# EAGLE design PowerDriver-Shield-v13 (EAGLE 5.11)
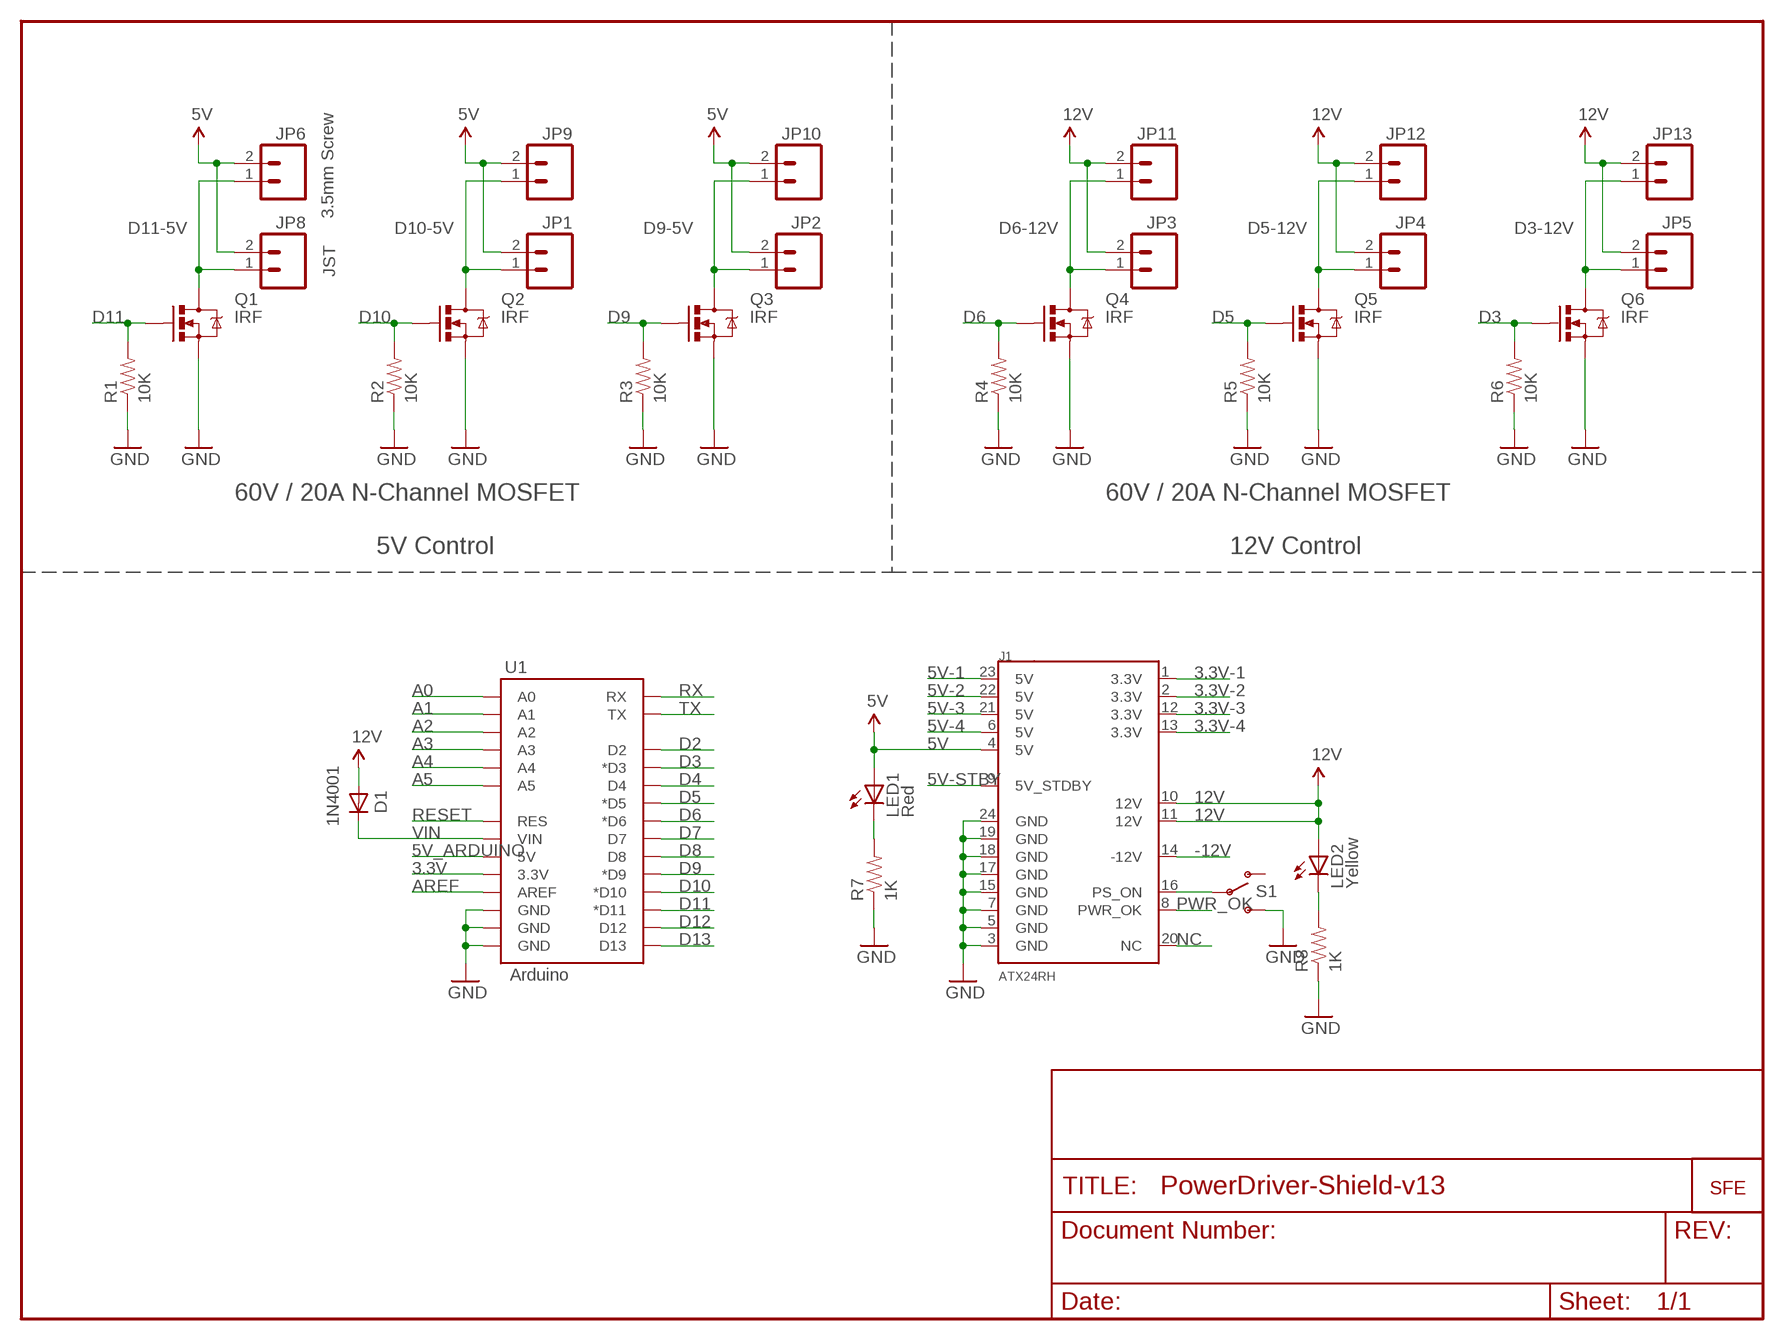
[diagram p0: schematic, sheet 1]

## Parts
D1  1N4001  DIODEPTH  [DIODE-1N4001]
J1  ATX24RH  [ATX24_RIGHT_ANGLE]
JP1  M02JST-PTH-2-NS  [JST-2-PTH-NOSILK]
JP2  M02JST-PTH-2-NS  [JST-2-PTH-NOSILK]
JP3  M02JST-PTH-2-NS  [JST-2-PTH-NOSILK]
JP4  M02JST-PTH-2-NS  [JST-2-PTH-NOSILK]
JP5  M02JST-PTH-2-NS  [JST-2-PTH-NOSILK]
JP6  M023.5MM  [SCREWTERMINAL-3.5MM-2]
JP7  LOGO-SFENEW  [SFE-NEW-WEBLOGO]
JP8  M02JST-PTH-2-NS  [JST-2-PTH-NOSILK]
JP9  M023.5MM  [SCREWTERMINAL-3.5MM-2]
JP10  M023.5MM  [SCREWTERMINAL-3.5MM-2]
JP11  M023.5MM  [SCREWTERMINAL-3.5MM-2]
JP12  M023.5MM  [SCREWTERMINAL-3.5MM-2]
JP13  M023.5MM  [SCREWTERMINAL-3.5MM-2]
LED1  Red  LED5MM  [LED5MM]
LED2  Yellow  LED5MM  [LED5MM]
Q1  IRF  MOSFET-NCHANNELPTH2  [TO220V]
Q2  IRF  MOSFET-NCHANNELPTH2  [TO220V]
Q3  IRF  MOSFET-NCHANNELPTH2  [TO220V]
Q4  IRF  MOSFET-NCHANNELPTH2  [TO220V]
Q5  IRF  MOSFET-NCHANNELPTH2  [TO220V]
Q6  IRF  MOSFET-NCHANNELPTH2  [TO220V]
R1  10K  RESISTORAXIAL-0.3  [AXIAL-0.3]
R2  10K  RESISTORAXIAL-0.3  [AXIAL-0.3]
R3  10K  RESISTORAXIAL-0.3  [AXIAL-0.3]
R4  10K  RESISTORAXIAL-0.3  [AXIAL-0.3]
R5  10K  RESISTORAXIAL-0.3  [AXIAL-0.3]
R6  10K  RESISTORAXIAL-0.3  [AXIAL-0.3]
R7  1K  RESISTORAXIAL-0.3  [AXIAL-0.3]
R8  1K  RESISTORAXIAL-0.3  [AXIAL-0.3]
S1  SWITCH-SPSTPTH  [SWITCH-SPDT]
U1  Arduino  ARDUINO_SHIELDLABEL  [DUEMILANOVE_SHIELD]

## Nets
3.3V: U1.3.3V
3.3V-1: J1.1(3.3V)
3.3V-2: J1.2(3.3V)
3.3V-3: J1.12(3.3V)
3.3V-4: J1.13(3.3V)
5V: J1.4(5V) JP1.2 JP2.2 JP6.2 JP8.2 JP9.2 JP10.2 LED1.A
5V-1: J1.23(5V)
5V-2: J1.22(5V)
5V-3: J1.21(5V)
5V-4: J1.6(5V)
5V-STBY: J1.9(5V_STDBY)
5V_ARDUINO: U1.5V
12V: D1.A J1.10(12V) J1.11(12V) JP3.2 JP4.2 JP5.2 JP11.2 JP12.2 JP13.2 LED2.A
-12V: J1.14(-12V)
A0: U1.A0
A1: U1.A1
A2: U1.A2
A3: U1.A3
A4: U1.A4
A5: U1.A5
AREF: U1.AREF
D2: U1.D2
D3: Q6.1(G) R6.P$2 U1.D3(*D3)
D3-12V: JP5.1 JP13.1 Q6.2(D)
D4: U1.D4
D5: Q5.1(G) R5.P$2 U1.D5(*D5)
D5-12V: JP4.1 JP12.1 Q5.2(D)
D6: Q4.1(G) R4.P$2 U1.D6(*D6)
D6-12V: JP3.1 JP11.1 Q4.2(D)
D7: U1.D7
D8: U1.D8
D9: Q3.1(G) R3.P$2 U1.D9(*D9)
D9-5V: JP2.1 JP10.1 Q3.2(D)
D10: Q2.1(G) R2.P$2 U1.D10(*D10)
D10-5V: JP1.1 JP9.1 Q2.2(D)
D11: Q1.1(G) R1.P$2 U1.D11(*D11)
D11-5V: JP6.1 JP8.1 Q1.2(D)
D12: U1.D12
D13: U1.D13
GND: J1.3(GND) J1.5(GND) J1.7(GND) J1.15(GND) J1.17(GND) J1.18(GND) J1.19(GND) J1.24(GND) Q1.3(S) Q2.3(S) Q3.3(S) Q4.3(S) Q5.3(S) Q6.3(S) R1.P$1 R2.P$1 R3.P$1 R4.P$1 R5.P$1 R6.P$1 R7.P$1 R8.P$1 S1.3(S) U1.GND@0(GND) U1.GND@1(GND) U1.GND@2(GND)
N$1: LED2.K(C) R8.P$2
N$2: J1.16(PS_ON) S1.2(P)
N$13: LED1.K(C) R7.P$2
NC: J1.20(NC)
PWR_OK: J1.8(PWR_OK)
RESET: U1.RES
RX: U1.RX
TX: U1.TX
VIN: D1.C U1.VIN
Unconnected: S1.1(O)

## Notes on the sheet
- 3.5mm Screw
- JST
- 60V / 20A N-Channel MOSFET | 60V / 20A N-Channel MOSFET
- 5V Control | 12V Control

## Library data of the parts
D1 = SparkFun:DIODE: Diode These are standard reverse protection diodes and small signal diodes. SMA package can handle up to about 1A. SOD-323 can handle about 200mA. What the SOD-323 package when ordering, there are some mfgs out there that are 5-pin packages.
J1 = SparkFun:ATX24
JP1-JP6 JP8-JP13 = SparkFun:M02: Header 2 Standard 2-pin 0.1" header. Use with straight break away headers (SKU : PRT-00116), right angle break away headers (PRT-00553), swiss pins (PRT-00743), machine pins (PRT-00117), and female headers (PRT-00115). Molex polarized connector foot print use with SKU : PRT-08233 with associated crimp pins and housings.
JP7 = SparkFun:LOGO-SFE: Spark Fun Electronics PCB Logo This is the standard Spark Fun Electronics PCB logo.
LED1 LED2 = SparkFun:LED: LEDs Standard schematic elements and footprints for 5mm, 3mm, 1206, and 0603 sized LEDs. 5mm - Spark Fun Electronics SKU : COM-00529 (and others)
Q1-Q6 = SparkFun:MOSFET-NCHANNEL
R1-R8 = SparkFun:RESISTOR: Resistor Basic schematic elements and footprints for 0603, 1206, and PTH resistors.
S1 = SparkFun:SWITCH-SPST: SPST Switch Simple slide switch. Spark Fun Electronics SKU : COM-00102
U1 = SparkFun:ARDUINO_SHIELD

## Board
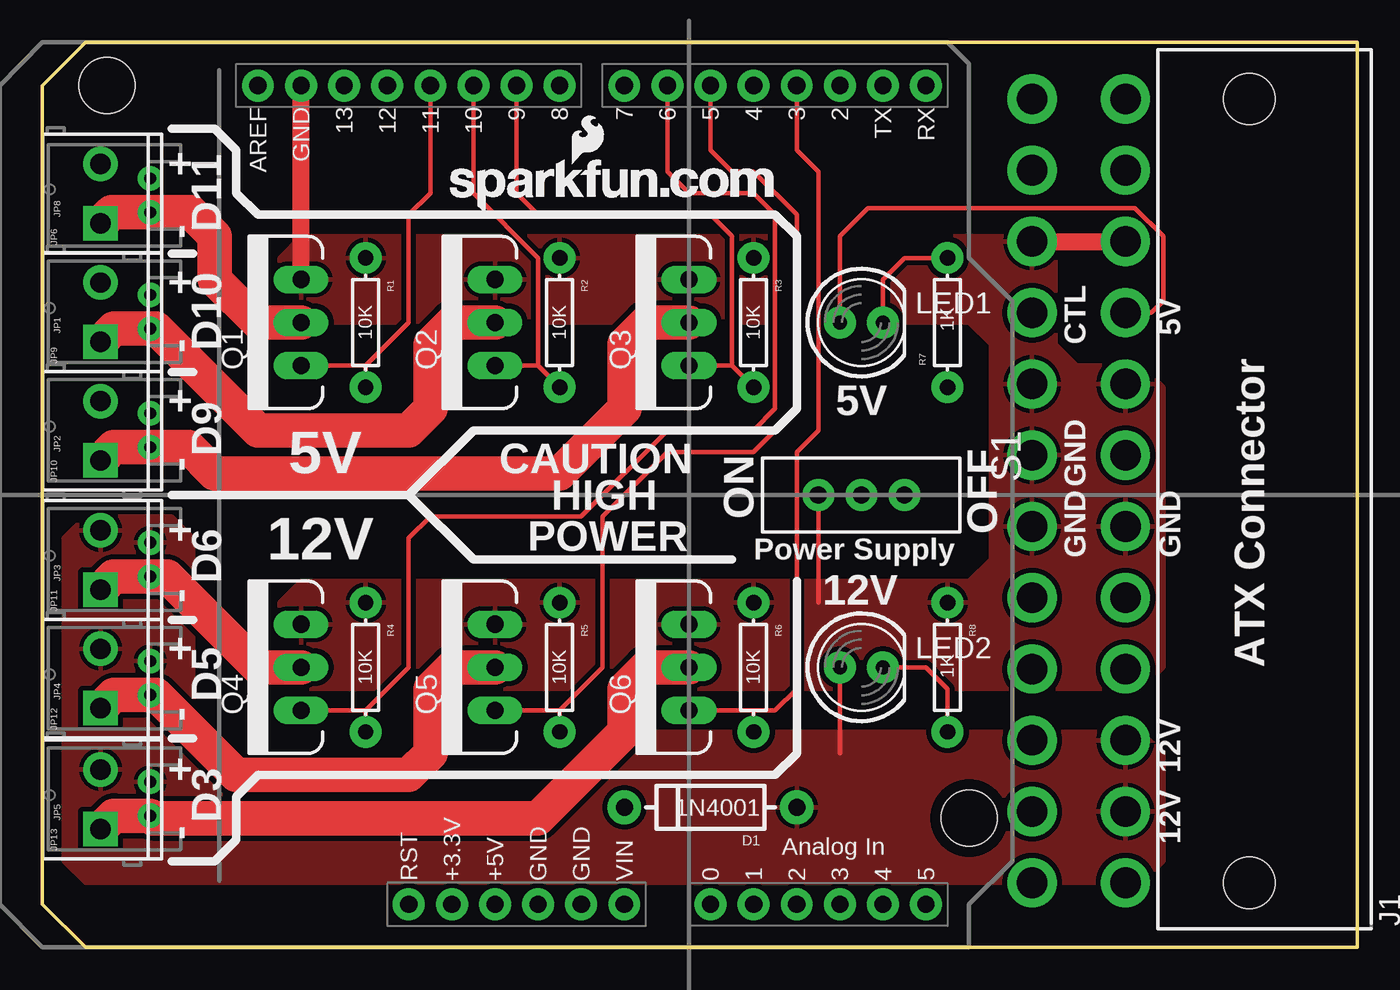
[diagram p1: board, top side]
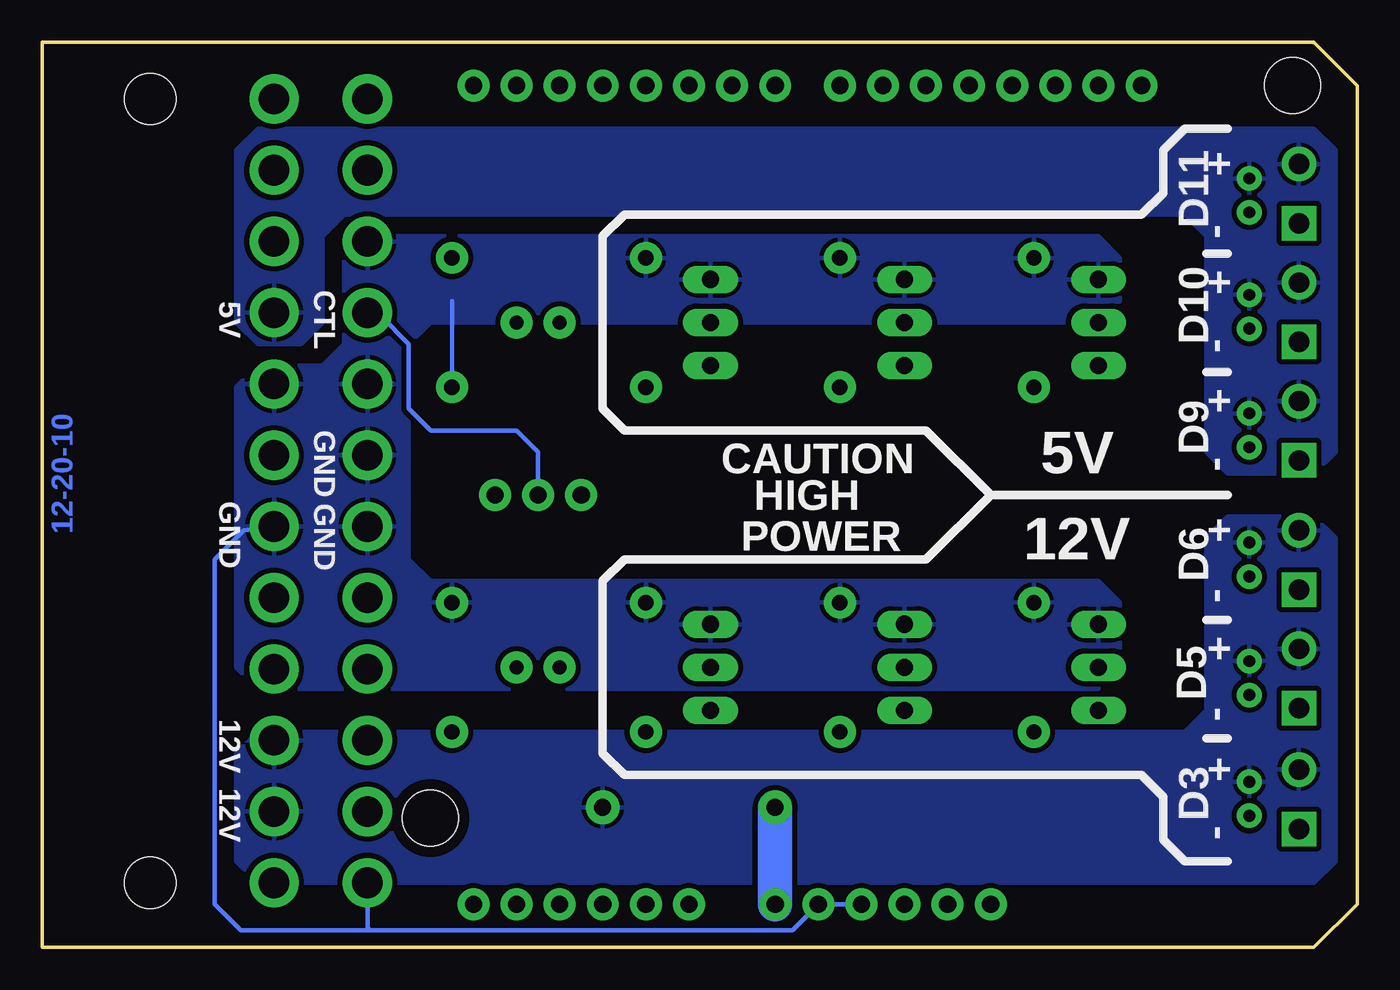
[diagram p2: board, bottom side, seen from below]

Size 77.47 x 53.34 mm. Coordinates in mm from the lower left corner, seen from the top.
Outline: 2.54,0 77.47,0 77.47,53.34 2.54,53.34 0,50.8 0,2.54 2.54,0
Copper layers (1*16): Top 0.035mm / dielectric 1.5mm / Bottom 0.035mm
Design rules "SparkFun": minimum track width 8mil, minimum drill 20mil, track to track 8mil, track to pad 8mil, pad to pad 8mil, via to via 8mil, smd to smd 8mil, copper to edge 10mil, drill to drill 8mil, minimum pad ring 12mil, minimum via ring 10mil, stop-mask expansion 4mil, vias tented up to drill 20mil, thermal gap 10mil

### Footprints (pad centres in the part's own frame; a part is rotated, then mirrored left to right if it is on the bottom)
DIODE-1N4001 = drill 1 pad 1.981 round: A -5.08,0; C 5.08,0
ATX24_RIGHT_ANGLE = drill 1.8 pad 2.9 round: 1 23.34,4.76; 2 19.14,4.76; 3 14.94,4.76; 4 10.74,4.76; 5 6.54,4.76; 6 2.34,4.76; 7 -1.86,4.76; 8 -6.06,4.76; 9 -10.26,4.76; 10 -14.46,4.76; 11 -18.66,4.76; 12 -22.86,4.76; 13 23.34,10.26; 14 19.14,10.26; 15 14.94,10.26; 16 10.74,10.26; 17 6.54,10.26; 18 2.34,10.26; 19 -1.86,10.26; 20 -6.06,10.26; 21 -10.26,10.26; 22 -14.46,10.26; 23 -18.66,10.26; 24 -22.86,10.26 | hole 3: -22.86,-2.54; 23.34,-2.54
JST-2-PTH-NOSILK = drill 0.7 pad 1.448 round: 1 -1,0; 2 1,0
SCREWTERMINAL-3.5MM-2 = drill 1.2 pad 2.032 square: 1 0,0 | drill 1.2 pad 2.032 round: 2 3.5,0
LED5MM = drill 0.813 pad 1.88 round: A -1.27,0; K 1.27,0
TO220V = drill 1.016 long: 1 -2.54,0; 2 0,0; 3 2.54,0
AXIAL-0.3 = drill 0.9 pad 1.88 round: P$1 -3.81,0; P$2 3.81,0
SWITCH-SPDT = drill 1.016 pad 1.88 round: 1 0,2.54; 2 0,0; 3 0,-2.54
DUEMILANOVE_SHIELD = drill 1.016 pad 1.88 round: 3.3V 50.8,26.67; 5V 50.8,29.21; A0 50.8,41.91; A1 50.8,44.45; A2 50.8,46.99; A3 50.8,49.53; A4 50.8,52.07; A5 50.8,54.61; AREF 2.54,15.24; D2 2.54,49.53; D3 2.54,46.99; D4 2.54,44.45; D5 2.54,41.91; D6 2.54,39.37; D7 2.54,36.83; D8 2.54,33.02; D9 2.54,30.48; D10 2.54,27.94; D11 2.54,25.4; D12 2.54,22.86; D13 2.54,20.32; GND@0 50.8,31.75; GND@1 50.8,34.29; GND@2 2.54,17.78; RES 50.8,24.13; RX 2.54,54.61; TX 2.54,52.07; VIN 50.8,36.83 | hole 3.302: 45.72,57.15; 2.54,6.35

### Placement (x,y rotation side)
D1  39.37,8.26 180 top
J1  68.58,26.67 90 top
JP1  6.35,37.47 90 top
JP2  6.35,30.48 90 top
JP3  6.35,22.86 90 top
JP4  6.35,15.88 90 top
JP5  6.35,8.76 90 top
JP6  3.43,42.67 90 top
JP7  24,43.31 0 top
JP8  6.35,44.32 90 top
JP9  3.43,35.69 90 top
JP10  3.43,28.7 90 top
JP11  3.43,21.08 90 top
JP12  3.43,14.1 90 top
JP13  3.43,6.99 90 top
LED1  48.26,36.83 0 top
LED2  48.26,16.51 0 top
Q1  15.24,36.83 90 top
Q2  26.67,36.83 90 top
Q3  38.1,36.83 90 top
Q4  15.24,16.51 90 top
Q5  26.67,16.51 90 top
Q6  38.1,16.51 90 top
R1  19.05,36.83 270 top
R2  30.48,36.83 270 top
R3  41.91,36.83 270 top
R4  19.05,16.51 270 top
R5  30.48,16.51 270 top
R6  41.91,16.51 270 top
R7  53.34,36.83 90 top
R8  53.34,16.51 270 top
S1  48.26,26.67 270 top
U1  -2.54,53.34 270 top

### Tracks (layer width: path | path; a pad name or v marks a point on that pad's centre or on a via)
5V
  Top 0.254: LED1.A 46.99,41.91 48.64,43.56 64.39,43.56 66.04,41.91 66.04,38.1 65.35,37.41 J1.4
  pour Bottom (isolate 0.305): 1.27,46.99 2.54,48.26 64.77,48.26 66.04,46.99 66.04,36.83 64.77,35.56 62.23,35.56 60.96,36.83 60.96,41.91 59.69,43.18 10.16,43.18 8.89,41.91 8.89,29.21 7.62,27.94 2.54,27.94 1.27,29.21
12V
  Top 0.254: 46.99,11.43 LED2.A
  pour Top (isolate 0.305): 1.27,24.13 2.54,25.4 7.62,25.4 8.89,24.13 8.89,13.97 10.16,12.7 64.77,12.7 66.04,11.43 66.04,5.08 64.77,3.81 2.54,3.81 1.27,5.08
  pour Bottom (isolate 0.305): 64.77,3.81 2.54,3.81 1.27,5.08 1.27,24.13 2.54,25.4 7.62,25.4 8.89,24.13 8.89,13.97 10.16,12.7 64.77,12.7 66.04,11.43 66.04,5.08
D3
  Top 0.254: U1.D3 44.45,46.99 45.72,45.72 45.72,30.48 44.45,29.21 44.45,15.24 43.18,13.97 41.91,13.97 | Q6.1 41.91,13.97 | 41.91,13.97 R6.P$2
D3-12V
  Top 2.032: Q6.2 35.56,16.51 34.29,15.24 34.29,12.7 29.21,7.62 6.49,7.62 JP5.1 4.21,7.76 JP13.1
D5
  Top 0.254: U1.D5 39.37,46.99 40.64,45.72 41.91,45.72 44.45,43.18 44.45,31.75 41.91,29.21 36.83,29.21 33.02,25.4 33.02,16.51 30.48,13.97 | Q5.1 30.48,13.97 | 30.48,13.97 R5.P$2
D5-12V
  Top 2.032: Q5.2 24.13,16.51 22.86,15.24 22.86,11.43 21.59,10.16 11.43,10.16 6.72,14.88 JP4.1 4.21,14.88 JP12.1
D6
  Top 0.254: Q4.1 19.05,13.97 | 19.05,13.97 R4.P$2 | 19.05,13.97 21.59,16.51 21.59,24.13 22.86,25.4 31.75,25.4 36.83,30.48 41.91,30.48 43.18,31.75 43.18,43.18 41.91,44.45 38.1,44.45 36.83,45.72 U1.D6
D6-12V
  Top 2.032: Q4.2 12.7,16.51 7.35,21.86 JP3.1 4.21,21.86 JP11.1
D9
  Top 0.254: Q3.1 40.64,34.29 | U1.D9 27.94,44.45 29.21,43.18 39.37,43.18 40.64,41.91 40.64,34.29 | 40.64,34.29 R3.P$2
D9-5V
  Top 2.032: Q3.2 35.56,36.83 34.29,35.56 34.29,31.75 30.48,27.94 10.16,27.94 8.62,29.48 JP2.1 4.21,29.48 JP10.1
D10
  Top 0.254: Q2.1 29.21,34.29 | U1.D10 25.4,44.45 29.21,40.64 29.21,34.29 | 29.21,34.29 R2.P$2
D10-5V
  Top 2.032: Q2.2 24.13,36.83 22.86,35.56 22.86,31.75 21.59,30.48 12.7,30.48 6.72,36.47 JP1.1 4.21,36.47 JP9.1
D11
  Top 0.254: U1.D11 22.86,44.45 21.59,43.18 21.59,36.83 19.05,34.29 | Q1.1 19.05,34.29 | 19.05,34.29 R1.P$2
D11-5V
  Top 2.032: Q1.2 12.7,36.83 10.16,39.37 10.16,41.91 8.75,43.32 JP8.1 4.08,43.32 JP6.1
GND
  Top 0.254: 45.72,20.32 S1.3
  Top 1.016: Q1.3 U1.GND@2 | J1.15 J1.3
  Bottom 0.254: R7.P$1 53.34,38.1 | U1.GND@0 U1.GND@1 33.27,1.02 58.17,1.02 | J1.7 65.6,24.57 67.31,22.86 67.31,2.54 65.79,1.02 58.17,1.02 | J1.24 58.32,1.17 58.17,1.02
  pour Bottom (isolate 0.305): 15.24,41.91 58.42,41.91 59.69,40.64 59.69,35.56 60.96,34.29 64.77,34.29 66.04,33.02 66.04,16.51 64.77,15.24 15.24,15.24 13.97,16.51 13.97,20.32 15.24,21.59 54.61,21.59 55.88,22.86 55.88,35.56 54.61,36.83 15.24,36.83 13.97,38.1 13.97,40.64
  pour Top (isolate 0.305): 15.24,15.24 64.77,15.24 66.04,16.51 66.04,33.02 64.77,34.29 60.96,34.29 59.69,35.56 59.69,40.64 58.42,41.91 15.24,41.91 13.97,40.64 13.97,38.1 15.24,36.83 54.61,36.83 55.88,35.56 55.88,22.86 54.61,21.59 15.24,21.59 13.97,20.32 13.97,16.51
N$1
  Top 0.254: LED2.K 52.07,16.51 53.34,15.24 R8.P$2
N$2
  Bottom 0.254: J1.16 57.49,37.17 55.88,35.56 55.88,31.75 54.61,30.48 49.53,30.48 48.26,29.21 S1.2
N$13
  Top 0.254: LED1.K 49.53,39.37 50.8,40.64 R7.P$2
VIN
  Bottom 2.032: U1.VIN D1.C

### Text on the board
Bottom: 12-20-10
tPlace: + | - | D11 | + | CTL | 5V | - | D10 | + | 5V | D9 | - | 5V | CAUTION | GND | HIGH | ON | + | OFF | 12V | POWER | Power Supply | GND | GND | D6 | - | 12V | + | ATX Connector | D5 | - | + | 12V | D3 | - | 12V
bPlace: D11 | + | - | D10 | CTL | + | 5V | - | D9 | + | GND | - | 5V | CAUTION | HIGH | GND | GND | D6 | + | 12V | POWER | - | D5 | + | - | 12V | D3 | + | 12V | -